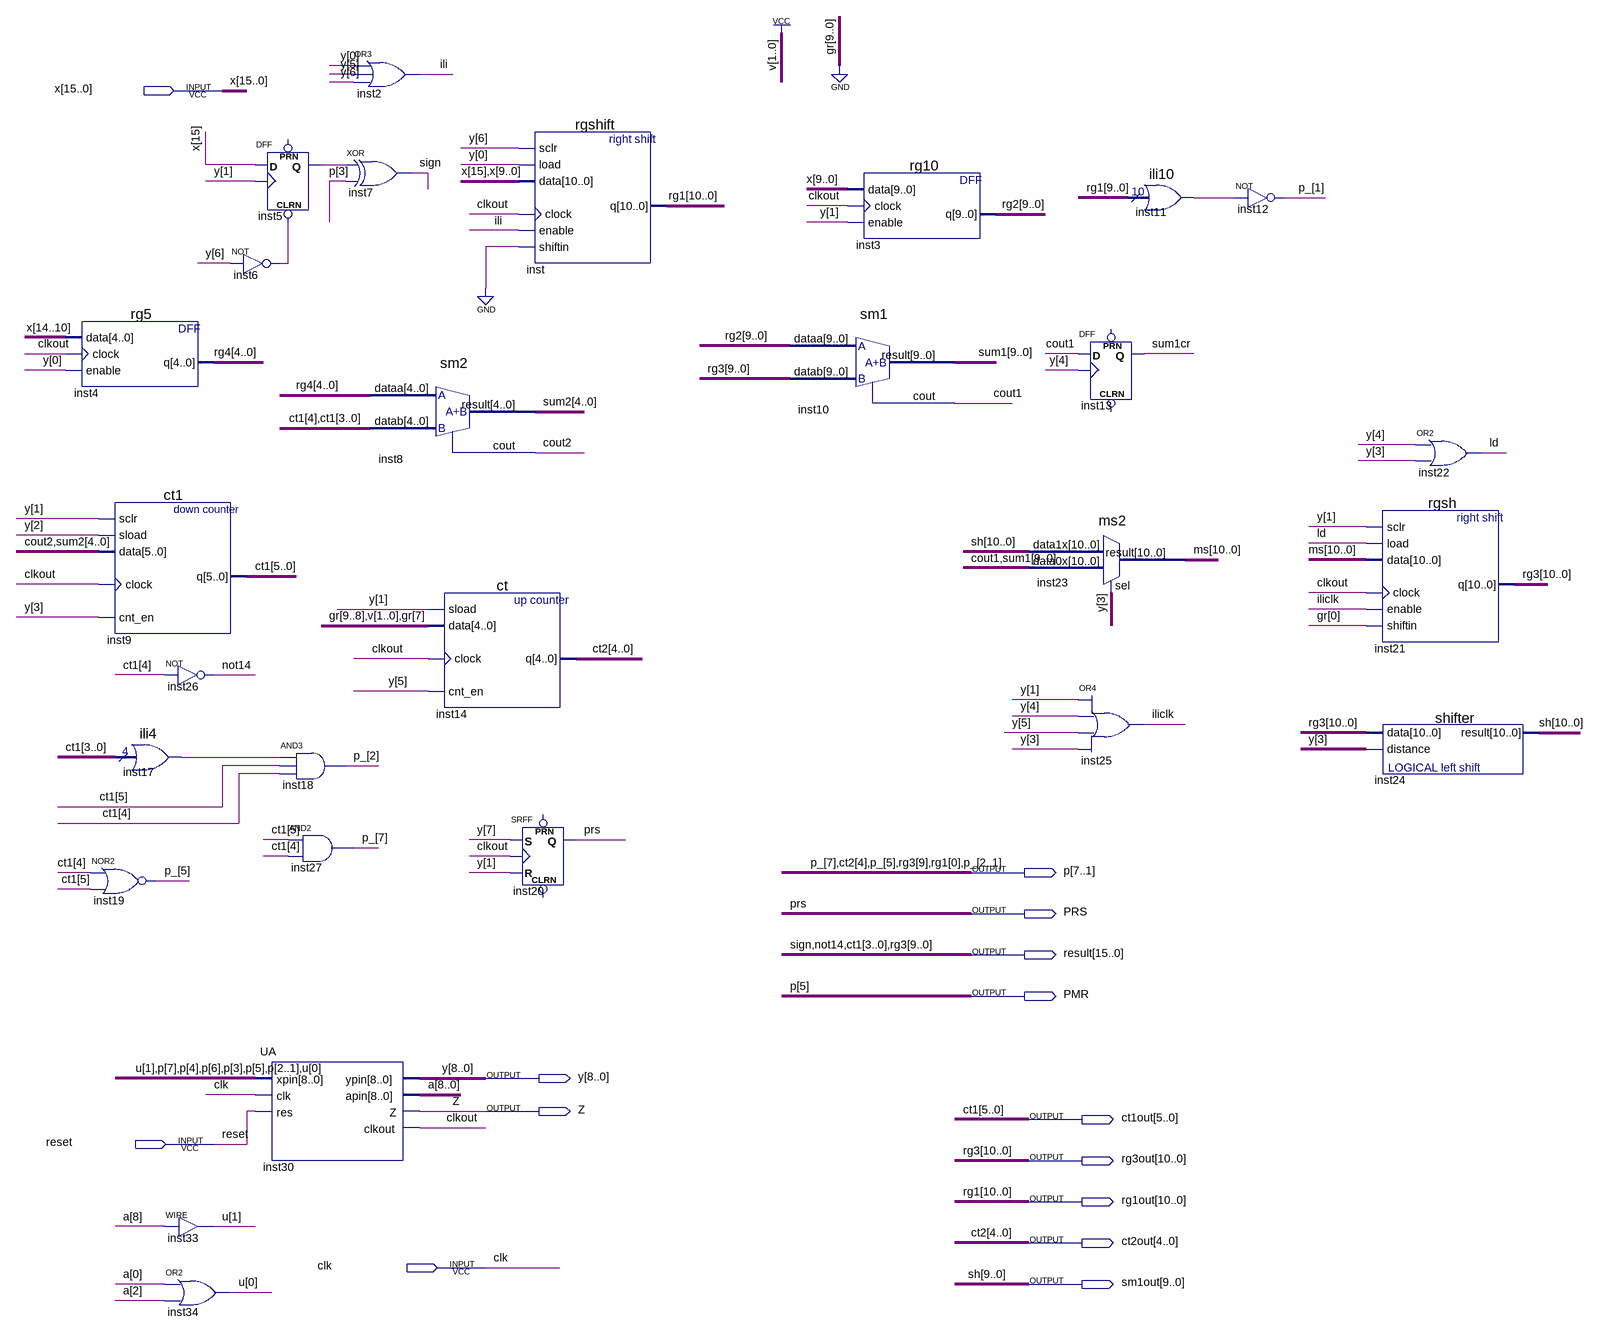
[diagram p0: schematic sheet]
// Quartus schematic FirstProgramm.bdf as structural Verilog: 28 symbols, 14 pins
module FirstProgramm (
  input  [15:0] x,
  input  reset,
  input  clk,
  output [7:1] p,
  output PRS,
  output [15:0] result,
  output PMR,
  output [8:0] y,
  output Z,
  output [5:0] ct1out,
  output [10:0] rg3out,
  output [10:0] rg1out,
  output [4:0] ct2out,
  output [9:0] sm1out
);

  wire clkout, cout1, cout2, ili, iliclk, inst5_q, inst6_out, inst11_result, inst17_result, ld, sum1cr;
  wire [1:0] u;
  wire [4:0] rg4, sum2;
  wire [8:0] a;
  wire [9:0] rg2, sum1;
  wire [10:0] ms;
  wire [10:10] sh;

  rg5 inst4 (.data(x[14:10]), .clock(clkout), .enable(y[0]), .q(rg4));
  ct1 inst9 (.sclr(y[1]), .sload(y[2]), .data({cout2, sum2}), .clock(clkout), .cnt_en(y[3]), .q(ct1out));
  ili4 inst17 (.data(ct1out[3:0]), .result(inst17_result));
  nor inst19 (p[5], ct1out[4], ct1out[5]);
  not inst26 (result[14], ct1out[4]);
  assign u[1] = a[8];  // WIRE inst33
  or inst34 (u[0], a[0], a[2]);
  not inst6 (inst6_out, y[6]);
  DFF inst5 (.CLRN(inst6_out), .CLK(y[1]), .D(x[15]), .Q(inst5_q));  // open: PRN
  and inst18 (p[2], inst17_result, ct1out[5], ct1out[4]);
  and inst27 (p[7], ct1out[5], ct1out[4]);
  UA inst30 (
    .xpin({u[1], p[7], p[4], ct2out[4], p[3], p[5], p[2:1], u[0]}), .clk(clk), .res(reset), .ypin(y),
    .apin(a), .Z(Z), .clkout(clkout));
  or inst2 (ili, y[0], y[5], y[6]);
  xor inst7 (result[15], inst5_q, p[3]);
  sm2 inst8 (.dataa(rg4), .datab(ct1out[4:0]), .result(sum2), .cout(cout2));
  ct inst14 (.sload(y[1]), .data(5'b00110), .clock(clkout), .cnt_en(y[5]), .q(ct2out));
  SRFF inst20 (.S(y[7]), .R(y[1]), .CLK(clkout), .Q(PRS));  // open: PRN, CLRN
  rgshift inst (
    .sclr(y[6]), .load(y[0]), .data({x[15], x[9:0]}), .clock(clkout), .enable(ili), .shiftin(1'b0),
    .q({rg1out[10:1], p[3]}));
  sm1 inst10 (.dataa(rg2), .datab({p[4], result[8:0]}), .result(sum1), .cout(cout1));
  rg10 inst3 (.data(x[9:0]), .clock(clkout), .enable(y[1]), .q(rg2));
  ms2 inst23 (.data1x({sh[10], sm1out}), .data0x({cout1, sum1}), .sel(y[3]), .result(ms));
  DFF inst13 (.CLK(y[4]), .D(cout1), .Q(sum1cr));  // open: CLRN, PRN
  or inst25 (iliclk, y[1], y[4], y[5], y[3]);
  ili10 inst11 (.data({rg1out[9:1], p[3]}), .result(inst11_result));
  not inst12 (p[1], inst11_result);
  rgsh inst21 (
    .sclr(y[1]), .load(ld), .data(ms), .clock(clkout), .enable(iliclk), .shiftin(1'b0),
    .q({rg3out[10], p[4], result[8:0]}));
  shifter inst24 (.data({rg3out[10], p[4], result[8:0]}), .distance(y[3]), .result({sh[10], sm1out}));
  or inst22 (ld, y[4], y[3]);

  assign p[6] = ct2out[4];
  assign PMR = p[5];
  assign result[13:9] = {ct1out[3:0], p[4]};
  assign rg1out[0] = p[3];
  assign rg3out[9:0] = {p[4], result[8:0]};

  // Other names for the same wires on the sheet: ct1[5:0] = ct1out; ct2[4:0] = ct2out; not14 = result[14];
  //   p_ (some bits) = {p[7], p[5], p[2:1]}; rg1[10:0] = {rg1out[10:1], p[3]};
  //   rg3[10:0] = {rg3out[10], p[4], result[8:0]}; sh[9:0] = sm1out; sign = result[15]
endmodule
